# EAGLE design mintyboostv2 (EAGLE 5.10)
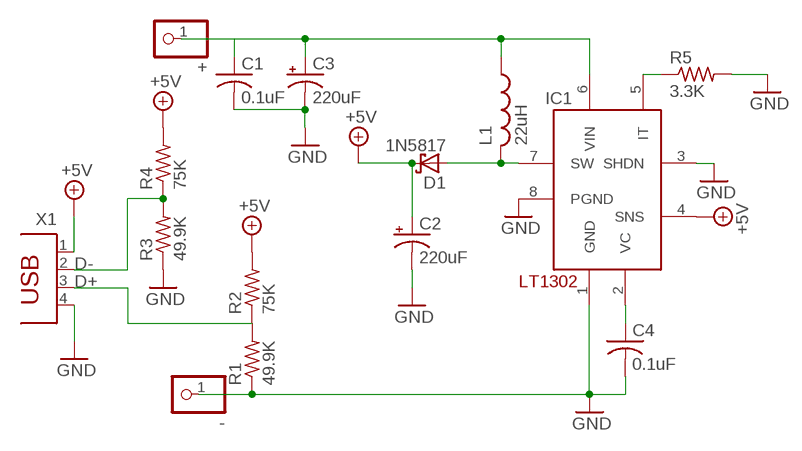
[diagram p0: schematic, sheet 1]

## Parts
+  PINHD-1X1  [1X01]
-  PINHD-1X1  [1X01]
C1  0.1uF  C-US025-024X044  [C025-024X044]
C2  220uF  CPOL-USE2.5-6  [E2,5-6]
C3  220uF  CPOL-USE2.5-6  [E2,5-6]
C4  0.1uF  C-US025-024X044  [C025-024X044]
D1  1N5817  SCHOTTKY-DIODEDO41  [DO41-10]
IC1  LT1302  [DIL08]
L1  22uH  L  [6000]
R1  49.9K  R-US_0207/5V  [0207/5V]
R2  75K  R-US_0207/5V  [0207/5V]
R3  49.9K  R-US_0207/5V  [0207/5V]
R4  75K  R-US_0207/5V  [0207/5V]
R5  3.3K  R-US_0207/5V  [0207/5V]
X1  PN87520  [PN87520]

## Nets
+5V: C2.+ D1.C IC1.4(SNS) R2.2 R4.2 X1.1
D+: R1.2 R2.1 X1.3
D-: R3.2 R4.1 X1.2
GND: -.1 C1.2 C2.- C3.- C4.2 IC1.1(GND) IC1.3(SHDN) IC1.8(PGND) R1.1 R3.1 R5.2 X1.4
N$1: C4.1 IC1.2(VC)
N$2: +.1 C1.1 C3.+ IC1.6(VIN) L1.1
N$3: IC1.5(IT) R5.1
N$5: D1.A IC1.7(SW) L1.2

## Library data of the parts
+ - = pinhead-ez:PINHD-1X1: PIN HEADER
C1 C4 = rcl-ez:C-US: CAPACITOR, American symbol
C2 C3 = rcl-ez:CPOL-US: POLARIZED CAPACITOR, American symbol
D1 = usbbuck:SCHOTTKY-DIODE: Schottky Diode
IC1 = usbbuck:LT1302
L1 = usbbuck:L
R1-R5 = rcl-ez:R-US_: RESISTOR, American symbol
X1 = con-berg:PN87520: BERG USB connector

## Board
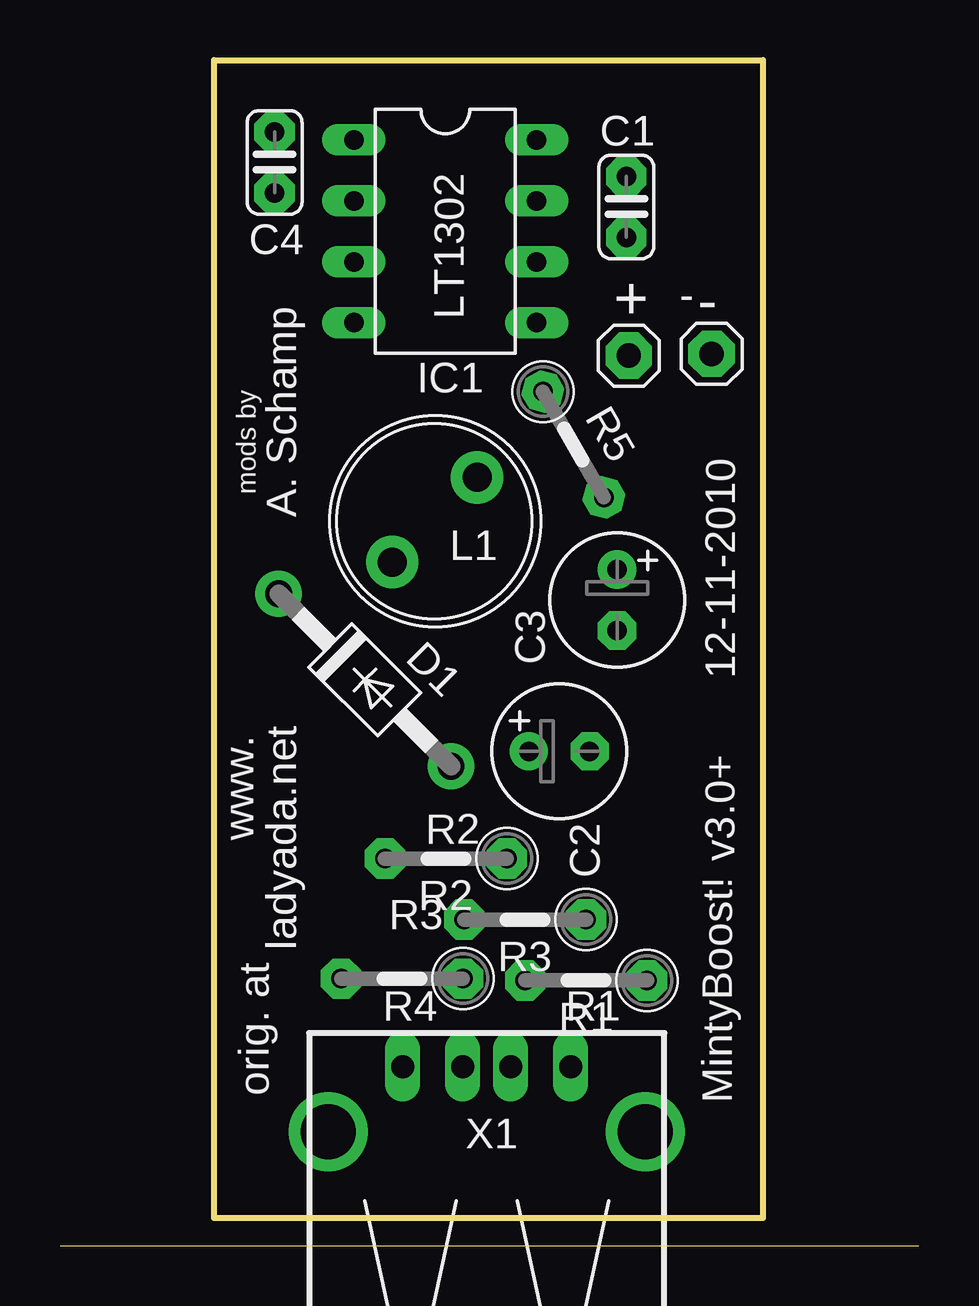
[diagram p1: board, top side]
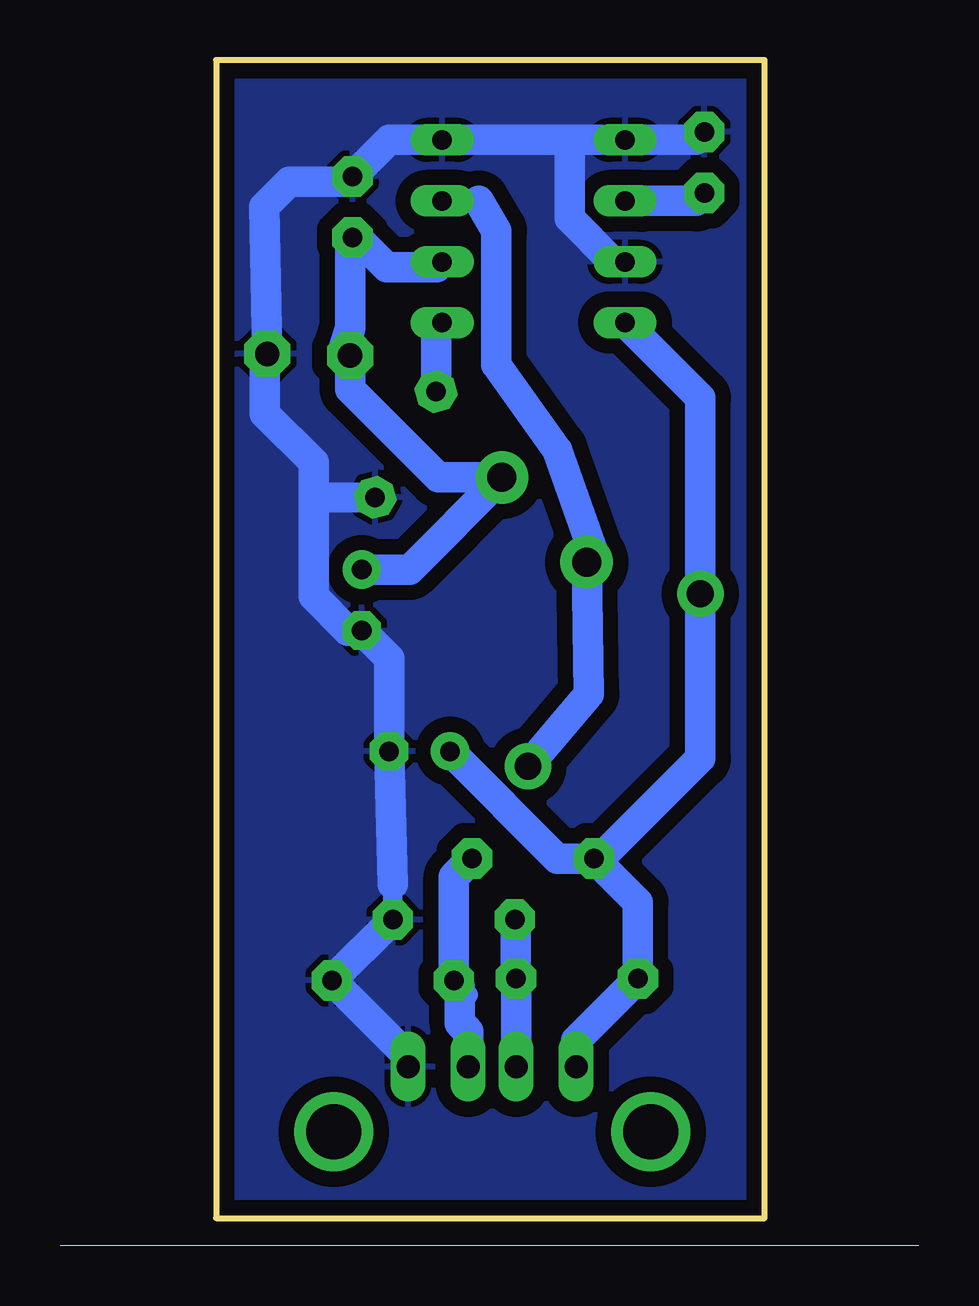
[diagram p2: board, bottom side, seen from below]

Size 35.79 x 49.4 mm. Coordinates in mm from the lower left corner, seen from the top.
Outline: 0,0 35.79,0
Outline: 6.43,1.14 6.43,49.4 29.29,49.4 29.29,1.14 6.43,1.14
Copper layers (1*16): Top 0.035mm / dielectric 1.5mm / Bottom 0.035mm
Design rules "default": minimum track width 12mil, minimum drill 20mil, track to track 12mil, track to pad 12mil, pad to pad 12mil, via to via 12mil, smd to smd 0mil, copper to edge 10mil, drill to drill 8mil, minimum pad ring 10mil, minimum via ring 8mil, stop-mask expansion 4mil, vias tented up to drill 0mil, thermal gap 10mil

### Footprints (pad centres in the part's own frame; a part is rotated, then mirrored left to right if it is on the bottom)
1X01 = drill 1.016 pad 1.93 octagon: 1 0,0
C025-024X044 = drill 0.813 pad 1.676 octagon: 1 -1.27,0; 2 1.27,0
E2,5-6 = drill 0.813 pad 1.6 round: + -1.27,0 | drill 0.813 pad 1.6 octagon: - 1.27,0
DO41-10 = drill 1.118 pad 1.93 round: A 5.08,0; C -5.08,0
DIL08 = drill 0.813 long: 1 -3.81,-3.81; 2 -1.27,-3.81; 3 1.27,-3.81; 4 3.81,-3.81; 5 3.81,3.81; 6 1.27,3.81; 7 -1.27,3.81; 8 -3.81,3.81
6000 = drill 1.2 pad 2.184 round: 1 -2.5,0; 2 2.5,0
0207/5V = drill 0.813 pad 1.676 octagon: 1 -2.54,0; 2 2.54,0
PN87520 = drill 0.95 long: 1 -3.5,2.71; 2 -1,2.71; 3 1,2.71; 4 3.5,2.71 | drill 2.286 round: P$1 -6.604,0; P$2 6.604,0

### Placement (x,y rotation side)
+  23.7,37.08 0 top
-  27.15,37.16 0 top
C1  23.6,43.28 90 top
C2  20.8,20.6 0 top
C3  23.22,26.9 270 top
C4  8.94,45.14 90 top
D1  12.7,23.57 315 top
IC1  16.05,42.27 270 top
L1  15.61,30.25 225 top
R1  21.92,11.05 180 top
R2  16.08,16.13 180 top
R3  19.38,13.59 180 top
R4  14.25,11.13 180 top
R5  21.39,33.38 300 top
X1  17.78,4.75 0 top

### Tracks (layer width: path | path; a pad name or v marks a point on that pad's centre or on a via)
+5V
  Bottom 0.813: R2.2 14.05,16.13 13.79,16.38 13.03,16.38
  Bottom 1.27: X1.1 14.28,8.55 R4.2 11.71,14.3 R2.2 | 14.05,16.13 15.06,16.13 C2.+ | 13.03,16.38 9.11,20.3 D1.C 9.11,35.32 IC1.4
D+
  Bottom 0.813: R1.2 18.78,10.45
  Bottom 1.27: R2.1 19.38,15.37 R1.2 19.13,10.79 19.13,9.27 18.78,8.93 X1.3
D-
  Bottom 0.813: R4.1 | 16.79,13.54 R3.2
  Bottom 1.27: X1.2 R4.1 | R4.1 16.79,13.54
GND
  Bottom 0.813: X1.4 21.28,7.87 | R3.1 21.92,15.06 | 13.26,46.08 13.03,45.85 12.47,45.85 IC1.1 | 9.27,46.08 C4.2 | C3.- 23.8,25.63 | 27.25,37.01 -.1 | 23.83,44.32 C1.2
  Bottom 1.27: 21.28,7.87 R1.1 R3.1 | 21.92,15.06 C2.- 22.07,24.49 C3.- | IC1.3 12.75,41 14.55,42.8 14.55,46.08 | 14.55,46.08 13.26,46.08 | 14.55,46.08 IC1.8 22.07,46.08 C1.2 | IC1.1 9.27,46.08 | 23.8,25.63 25.22,27.05 25.22,31.16 | 25.22,31.16 R5.2 | 25.22,31.16 25.22,32.64 27.25,34.67 27.25,37.01 | -.1 27.28,43.28 26.24,44.32 23.83,44.32
  pour Bottom (isolate 0.635): 6.93,48.9 6.93,1.9 28.78,1.9 28.78,48.9
N$1
  Bottom 0.813: C4.1 9.27,43.54
  Bottom 1.27: 9.27,43.54 IC1.2
N$2
  Bottom 0.813: +.1 23.95,37.46 | 23.7,41.91 C1.1 23.42,42.01 | 20.09,40.77 IC1.6
  Bottom 1.27: C3.+ 21.22,28.17 L1.1 20.02,32.01 23.7,35.69 +.1 | 23.95,37.46 23.7,38.23 23.7,41.91 | 23.42,42.01 22.17,40.77 20.09,40.77
N$3
  Bottom 0.813: 20.12,38.2 IC1.5
  Bottom 1.27: R5.1 20.12,38.2
N$5
  Bottom 0.813: 18.34,43.54 IC1.7 | L1.2 13.54,28.78
  Bottom 1.27: D1.A 13.75,22.98 L1.2 | 18.34,43.54 17.6,42.29 17.6,36.7 15.06,33.15 13.54,28.78

### Text on the board
tPlace: C1 | C4 | LT1302 | + | - | IC1 | mods by | R5 | A. Schamp | L1 | C3 | D1 | 12-11-2010 | C2 | www. | R2 | MintyBoost! | v3.0+ | ladyada.net | R3 | orig. at | R4 | R1 | X1